# EAGLE board RAM Board trex (EAGLE 6.6.0)
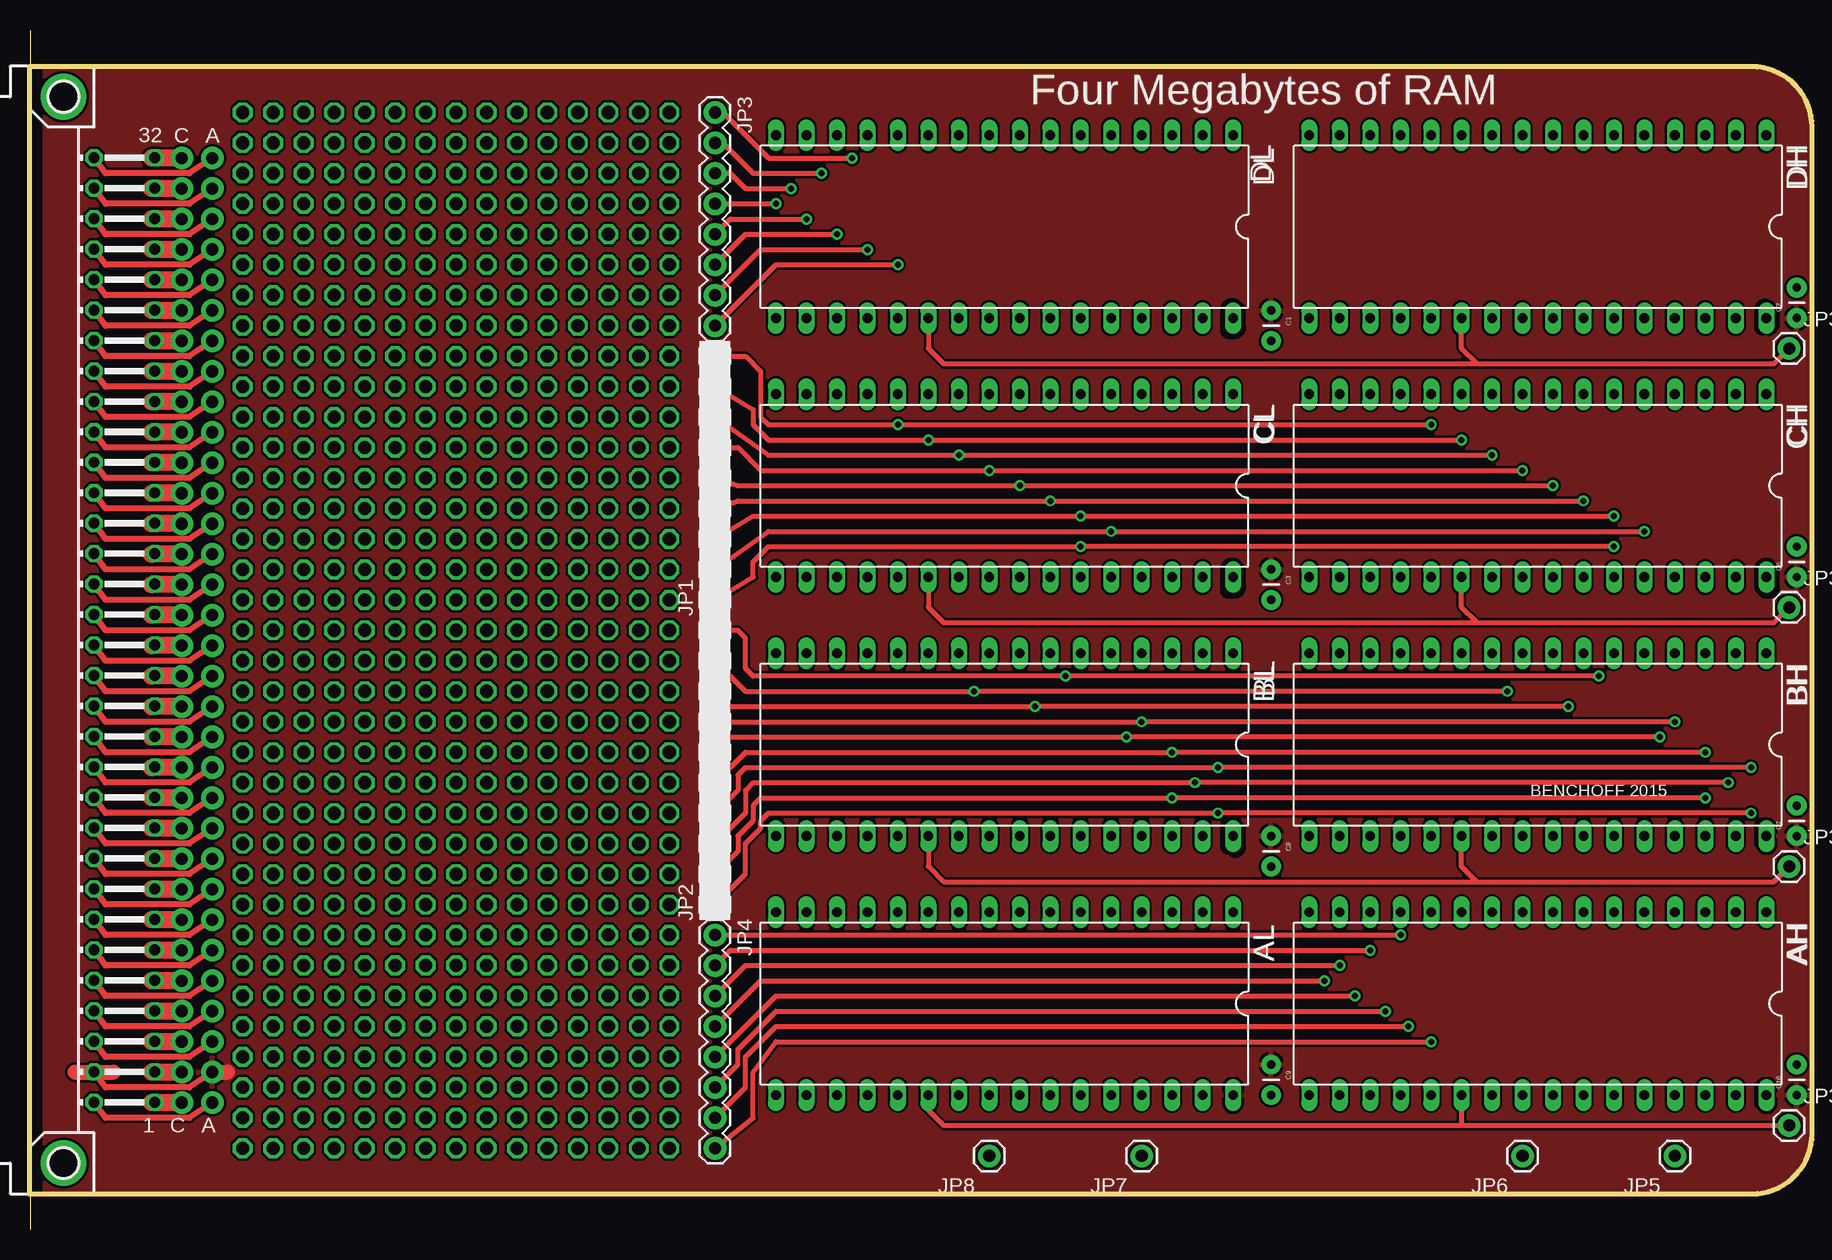
[diagram p1: board, top side]
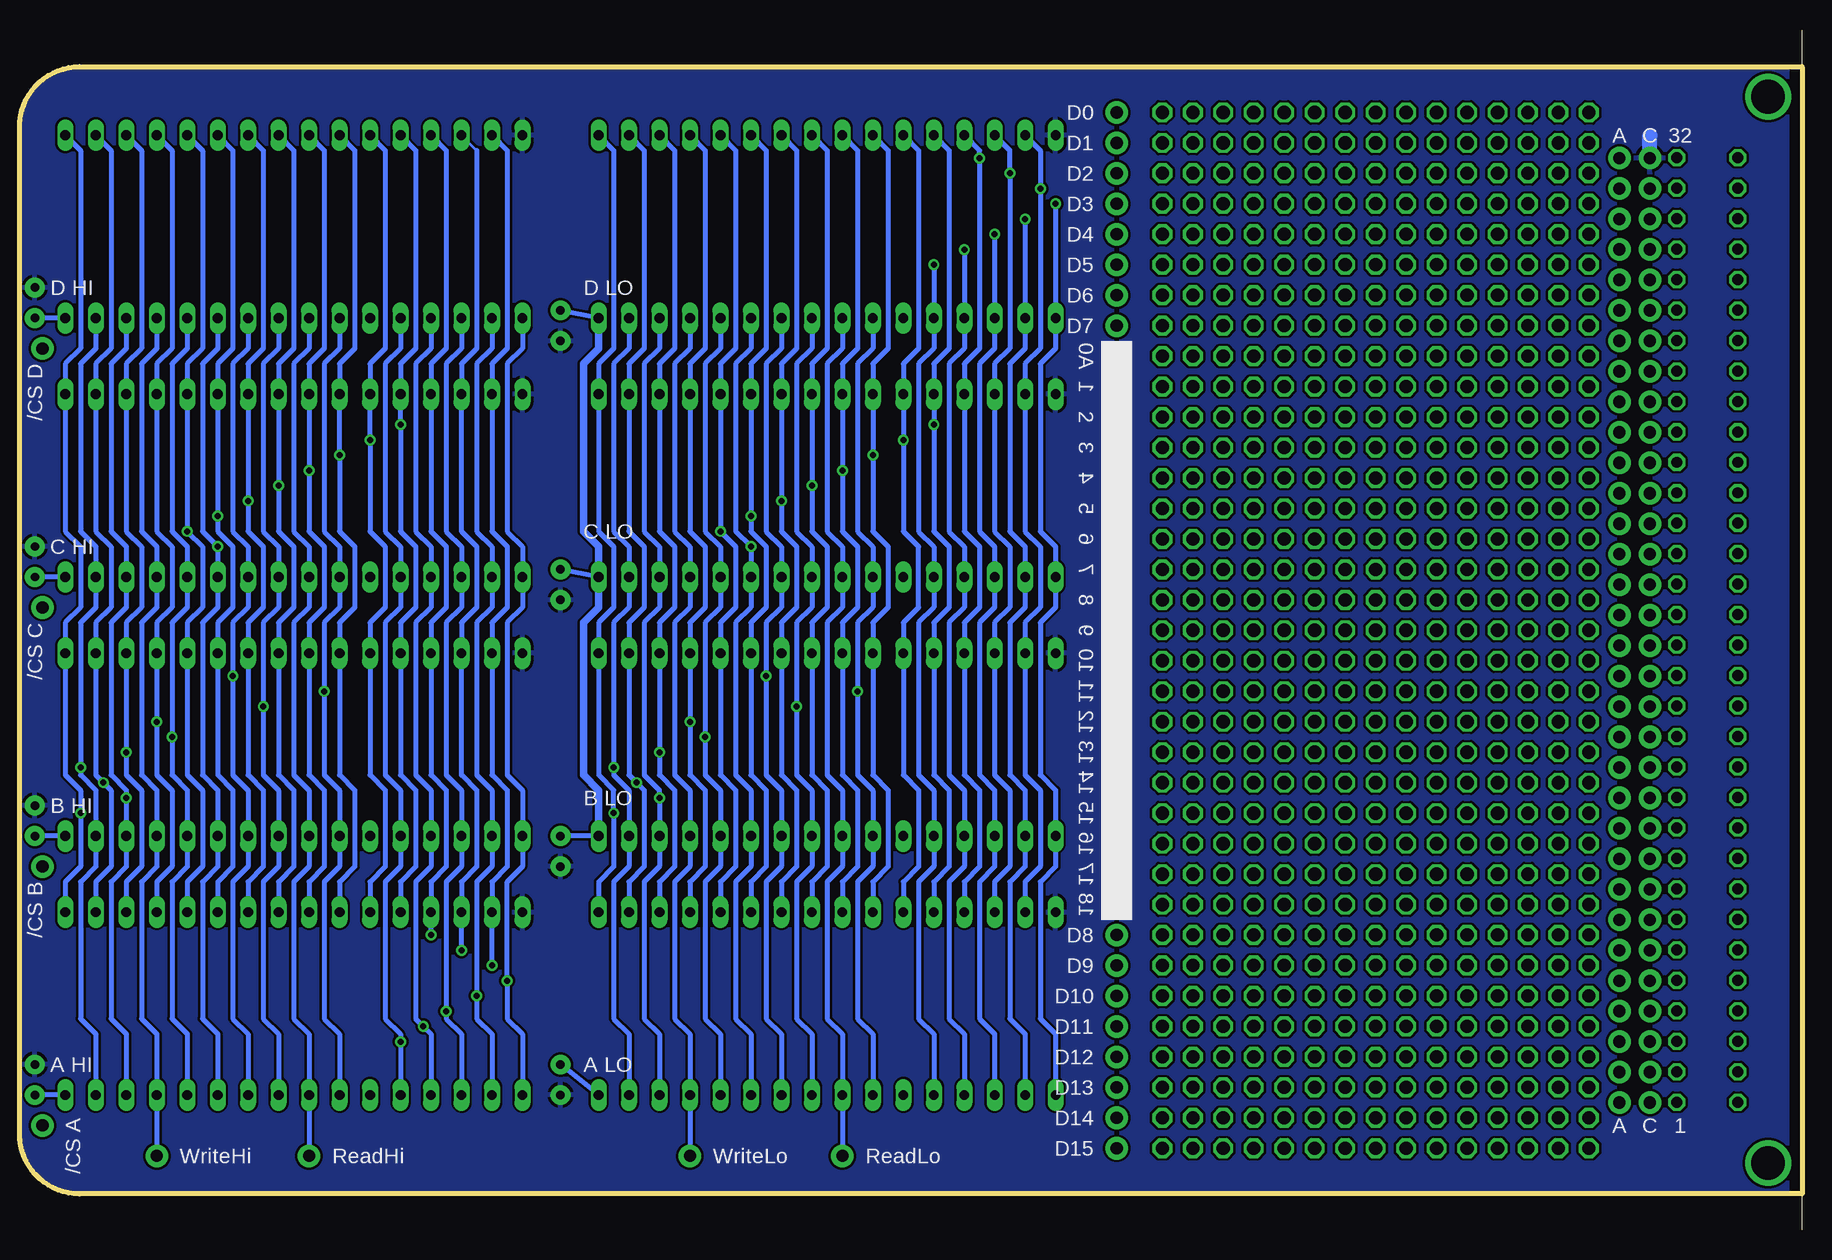
[diagram p2: board, bottom side, seen from below]

Size 0 x 100.03 mm. Coordinates in mm from the lower left corner, seen from the top.
Copper layers (1*16): Top 0.035mm / dielectric 1.5mm / Bottom 0.035mm
Design rules "default": minimum track width 10mil, minimum drill 24mil, track to track 8mil, track to pad 8mil, pad to pad 8mil, via to via 8mil, smd to smd 8mil, copper to edge 40mil, drill to drill 8mil, minimum pad ring 10mil, minimum via ring 8mil, stop-mask expansion 4mil, vias tented up to drill 0mil, thermal gap 10mil
tRestrict: area 99.6,31.6 to 100.9,34.1; area 99.6,31.6 to 100.9,34.1; area 99.8,31.6 to 100.7,33.7; area 99.8,53.3 to 100.7,55.4; area 99.8,74.9 to 100.7,77; area 144.3,75.2 to 145.2,77; area 144.3,53.3 to 145.2,55.4; area 144.3,31.9 to 144.9,33.7; area 144.6,10.3 to 144.9,12.1; area 144.3,10.6 to 144.9,12.1; area 100.1,10.3 to 100.4,12.1
Milling: 6 lines

## Footprints (pad centres in the part's own frame; a part is rotated, then mirrored left to right if it is on the bottom)
DIL32 = drill 0.813 long: 1 -17.78,-7.62; 2 -15.24,-7.62; 3 -12.7,-7.62; 4 -10.16,-7.62; 5 -7.62,-7.62; 6 -5.08,-7.62; 7 -2.54,-7.62; 8 0,-7.62; 9 2.54,-7.62; 10 5.08,-7.62; 11 7.62,-7.62; 12 10.16,-7.62; 13 12.7,-7.62; 14 15.24,-7.62; 15 17.78,-7.62; 16 20.32,-7.62; 17 20.32,7.62; 18 17.78,7.62; 19 15.24,7.62; 20 12.7,7.62; 21 10.16,7.62; 22 7.62,7.62; 23 5.08,7.62; 24 2.54,7.62; 25 0,7.62; 26 -2.54,7.62; 27 -5.08,7.62; 28 -7.62,7.62; 29 -10.16,7.62; 30 -12.7,7.62; 31 -15.24,7.62; 32 -17.78,7.62
CAP-PTH-SMALL = drill 0.7 pad 1.651: 1 0,0; 2 2.54,0
1X09 = drill 1.016 pad 1.88: 1 0,0; 2 2.54,0; 3 5.08,0; 4 7.62,0; 5 10.16,0; 6 12.7,0; 7 15.24,0; 8 17.78,0; 9 20.32,0
1X10 = drill 1.016 pad 1.88: 1 0,0; 2 2.54,0; 3 5.08,0; 4 7.62,0; 5 10.16,0; 6 12.7,0; 7 15.24,0; 8 17.78,0; 9 20.32,0; 10 22.86,0
1X08_ROUND = drill 1.016 pad 1.88: 1 0,0; 2 2.54,0; 3 5.08,0; 4 7.62,0; 5 10.16,0; 6 12.7,0; 7 15.24,0; 8 17.78,0
1X01 = drill 1.016 pad 1.88: 1 0,0
BLANKBOARD = drill 1.016 pad 1.88: 3V3 -13.97,37.465; 5V -16.51,34.925; 5VSB -13.97,34.925; 12V -16.51,37.465; 26 -13.97,6.985; 28 -13.97,4.445; 30 -13.97,1.905; 32 -13.97,-0.635; 34 -13.97,-3.175; 36 -13.97,-5.715; 40 -13.97,-10.795; -12V -16.51,-41.275; /AS -13.97,-20.955; /BOOT -16.51,12.065; /CLOCK -13.97,-26.035; /LDS -13.97,-18.415; /RESET -13.97,-8.255; /UDS -13.97,-15.875; /VMA -16.51,14.605; /VPA -16.51,9.525; A0 -13.97,-28.575; A1 -13.97,-31.115; A2 -13.97,-33.655; A3 -13.97,-36.195; A4 -13.97,-38.735; A5 -16.51,-38.735; A6 -16.51,-36.195; A7 -16.51,-33.655; A8 -16.51,-31.115; A9 -16.51,-28.575; A10 -16.51,-26.035; A11 -16.51,-23.495; A12 -16.51,-20.955; A13 -16.51,-18.415; A14 -16.51,-15.875; A15 -16.51,-13.335; A16 -16.51,-10.795; A17 -16.51,-8.255; A18 -16.51,-5.715; A19 -16.51,-3.175; A20 -16.51,-0.635; A21 -16.51,1.905; A22 -16.51,4.445; A23 -16.51,6.985; CLOCK -13.97,-23.495; D0 -16.51,19.685; D1 -16.51,22.225; D2 -16.51,24.765; D3 -16.51,27.305; D4 -16.51,29.845; D5 -16.51,32.385; D6 -13.97,32.385; D7 -13.97,29.845; D8 -13.97,27.305; D9 -13.97,24.765; D10 -13.97,22.225; D11 -13.97,19.685; D12 -13.97,17.145; D13 -13.97,14.605; D14 -13.97,12.065; D15 -13.97,9.525; E -16.51,17.145; GND -13.97,-41.275; R/W -13.97,-13.335 | drill 0.914 octagon: F1 -6.651,37.428; F2 -6.651,34.888; F3 -6.651,32.348; F4 -6.651,29.808; F5 -6.651,27.268; F6 -6.651,24.728; F7 -6.651,22.188; F8 -6.651,19.648; F9 -6.651,17.108; F10 -6.651,14.568; F11 -6.651,12.028; F12 -6.651,9.488; F13 -6.651,6.948; F14 -6.651,4.408; F15 -6.651,1.868; F16 -6.651,-0.672; F17 -6.651,-3.212; F18 -6.651,-5.752; F19 -6.651,-8.292; F20 -6.651,-10.832; F21 -6.651,-13.372; F22 -6.651,-15.912; F23 -6.651,-18.452; F24 -6.651,-20.992; F25 -6.651,-23.532; F26 -6.651,-26.072; F27 -6.651,-28.612; F28 -6.651,-31.152; F29 -6.651,-33.692; F30 -6.651,-36.232; F31 -6.651,-38.772; F32 -6.651,-41.312; R1 -11.731,-41.312; R2 -11.731,-38.772; R3 -11.731,-36.232; R4 -11.731,-33.692; R5 -11.731,-31.152; R6 -11.731,-28.612; R7 -11.731,-26.072; R8 -11.731,-23.532; R9 -11.731,-20.992; R10 -11.731,-18.452; R11 -11.731,-15.912; R12 -11.731,-13.372; R13 -11.731,-10.832; R14 -11.731,-8.292; R15 -11.731,-5.752; R16 -11.731,-3.212; R17 -11.731,-0.672; R18 -11.731,1.868; R19 -11.731,4.408; R21 -11.731,9.488; R22 -11.731,12.028; R23 -11.731,14.568; R24 -11.731,17.108; R25 -11.731,19.648; R26 -11.731,22.188; R27 -11.731,24.728; R28 -11.731,27.268; R29 -11.731,29.808; R30 -11.731,32.348; R31 -11.731,34.888; R32 -11.731,37.428; R200 -11.731,6.948 | drill 2.8: P$1 -4.111,42.508; P$2 -4.111,-46.392

## Placement (x,y rotation side)
AH  AS6C4008  [DIL32]  126.95,18.86 180 top  (outside the outline)
AL  AS6C4008  [DIL32]  82.5,18.86 180 top  (outside the outline)
BH  AS6C4008  [DIL32]  126.95,40.45 180 top  (outside the outline)
BL  AS6C4008  [DIL32]  82.5,40.45 180 top  (outside the outline)
C1  100nF  [CAP-PTH-SMALL]  103.46,76.65 270 top  (outside the outline)
C2  100nF  [CAP-PTH-SMALL]  147.27,76.01 90 top  (outside the outline)
C3  100nF  [CAP-PTH-SMALL]  103.46,55.06 270 top  (outside the outline)
C6  100nF  [CAP-PTH-SMALL]  147.27,54.42 90 top  (outside the outline)
C7  100nF  [CAP-PTH-SMALL]  147.27,32.83 90 top  (outside the outline)
C8  100nF  [CAP-PTH-SMALL]  103.46,32.83 270 top  (outside the outline)
C9  100nF  [CAP-PTH-SMALL]  103.46,13.78 270 top  (outside the outline)
C10  100nF  [CAP-PTH-SMALL]  147.27,11.24 90 top  (outside the outline)
CH  AS6C4008  [DIL32]  126.95,62.04 180 top  (outside the outline)
CL  AS6C4008  [DIL32]  82.5,62.04 180 top  (outside the outline)
DH  AS6C4008  [DIL32]  126.95,83.63 180 top  (outside the outline)
DL  AS6C4008  [DIL32]  82.5,83.63 180 top  (outside the outline)
JP1  M09  [1X09]  57.1,52.52 90 top  (outside the outline)
JP2  M10SILK_FEMALE_PTH  [1X10]  57.1,27.12 90 top  (outside the outline)
JP3  [1X08_ROUND]  57.1,93.16 270 top  (outside the outline)
JP4  [1X08_ROUND]  57.1,24.58 270 top  (outside the outline)
JP5  M01PTH  [1X01]  137.11,6.16 180 top  (outside the outline)
JP6  M01PTH  [1X01]  124.41,6.16 180 top  (outside the outline)
JP7  M01PTH  [1X01]  92.66,6.16 180 top  (outside the outline)
JP8  M01PTH  [1X01]  79.96,6.16 180 top  (outside the outline)
JP36  M01PTH  [1X01]  146.64,73.47 0 top  (outside the outline)
JP37  M01PTH  [1X01]  146.64,51.88 0 top  (outside the outline)
JP38  M01PTH  [1X01]  146.64,30.29 0 top  (outside the outline)
JP39  M01PTH  [1X01]  146.64,8.7 0 top  (outside the outline)
U$1  BACKPLANECONN  [BLANKBOARD]  -1.32,48.07 180 top

## Tracks (layer width: path | path; a pad name or v marks a point on that pad's centre or on a via)
ADDRESS0  (via drill 0.5 pad 0.25)
  Top 0.406: v116.79,67.12 v72.34,67.12 61.55,67.12 60.91,67.76 60.91,71.57 59.64,72.84 JP1.9
  Bottom 0.406: DH.12 115.52,89.98 115.52,73.47 116.79,72.2 CH.12 v116.79,67.12 116.79,58.23 115.52,56.96 115.52,51.88 116.79,50.61 BH.12 116.79,37.91 115.52,36.64 115.52,30.29 116.79,29.02 AH.12 | AL.12 72.34,29.02 71.07,30.29 71.07,36.64 72.34,37.91 BL.12 72.34,50.61 71.07,51.88 71.07,56.96 72.34,58.23 v72.34,67.12 CL.12 72.34,72.2 71.07,73.47 71.07,89.98 DL.12
ADDRESS1  (via drill 0.5 pad 0.25)
  Top 0.406: v119.33,65.85 v74.88,65.85 61.55,65.85 60.28,67.12 60.28,68.39 JP1.8
  Bottom 0.406: DH.11 118.06,89.98 118.06,73.47 119.33,72.2 CH.11 v119.33,65.85 119.33,58.23 118.06,56.96 118.06,51.88 119.33,50.61 BH.11 119.33,37.91 118.06,36.64 118.06,30.29 119.33,29.02 AH.11 | AL.11 74.88,29.02 73.61,30.29 73.61,36.64 74.88,37.91 BL.11 74.88,50.61 73.61,51.88 73.61,56.96 74.88,58.23 v74.88,65.85 CL.11 74.88,72.2 73.61,73.47 73.61,89.98 DL.11
ADDRESS2  (via drill 0.5 pad 0.25)
  Top 0.406: v121.87,64.58 v77.42,64.58 61.55,64.58 JP1.7
  Bottom 0.406: DH.10 120.6,89.98 120.6,73.47 121.87,72.2 CH.10 v121.87,64.58 121.87,58.23 120.6,56.96 120.6,51.88 121.87,50.61 BH.10 121.87,37.91 120.6,36.64 120.6,30.29 121.87,29.02 AH.10 | AL.10 77.42,29.02 76.15,30.29 76.15,36.64 77.42,37.91 BL.10 77.42,50.61 76.15,51.88 76.15,56.96 77.42,58.23 v77.42,64.58 CL.10 77.42,72.2 76.15,73.47 76.15,89.98 DL.10
ADDRESS3  (via drill 0.5 pad 0.25)
  Top 0.406: v124.41,63.31 v79.96,63.31 60.91,63.31 59.01,65.22 JP1.6
  Bottom 0.406: DH.9 123.14,89.98 123.14,73.47 124.41,72.2 CH.9 v124.41,63.31 124.41,58.23 123.14,56.96 123.14,51.88 124.41,50.61 BH.9 124.41,37.91 123.14,36.64 123.14,30.29 124.41,29.02 AH.9 | AL.9 79.96,29.02 78.69,30.29 78.69,36.64 79.96,37.91 BL.9 79.96,50.61 78.69,51.88 78.69,56.96 79.96,58.23 v79.96,63.31 CL.9 79.96,72.2 78.69,73.47 78.69,89.98 DL.9
ADDRESS4  (via drill 0.5 pad 0.25)
  Top 0.406: v126.95,62.04 v82.5,62.04 59.01,62.04 JP1.5
  Bottom 0.406: DH.8 125.68,89.98 125.68,73.47 126.95,72.2 CH.8 v126.95,62.04 126.95,58.23 125.68,56.96 125.68,51.88 126.95,50.61 BH.8 126.95,37.91 125.68,36.64 125.68,30.29 126.95,29.02 AH.8 | AL.8 82.5,29.02 81.23,30.29 81.23,36.64 82.5,37.91 BL.8 82.5,50.61 81.23,51.88 81.23,56.96 82.5,58.23 v82.5,62.04 CL.8 82.5,72.2 81.23,73.47 81.23,89.98 DL.8
ADDRESS5  (via drill 0.5 pad 0.25)
  Top 0.406: v129.49,60.77 v85.04,60.77 59.01,60.77 JP1.4
  Bottom 0.406: DH.7 128.22,89.98 128.22,73.47 129.49,72.2 CH.7 v129.49,60.77 129.49,58.23 128.22,56.96 128.22,51.88 129.49,50.61 BH.7 129.49,37.91 128.22,36.64 128.22,30.29 129.49,29.02 AH.7 | AL.7 85.04,29.02 83.77,30.29 83.77,36.64 85.04,37.91 BL.7 85.04,50.61 83.77,51.88 83.77,56.96 85.04,58.23 v85.04,60.77 CL.7 85.04,72.2 83.77,73.47 83.77,89.98 DL.7
ADDRESS6  (via drill 0.5 pad 0.25)
  Top 0.406: v132.03,59.5 v87.58,59.5 60.28,59.5 JP1.3
  Bottom 0.406: DH.6 130.76,89.98 130.76,73.47 132.03,72.2 CH.6 v132.03,59.5 132.03,58.23 130.76,56.96 130.76,51.88 132.03,50.61 BH.6 132.03,37.91 130.76,36.64 130.76,30.29 132.03,29.02 AH.6 | AL.6 87.58,29.02 86.31,30.29 86.31,36.64 87.58,37.91 BL.6 87.58,50.61 86.31,51.88 86.31,56.96 87.58,58.23 v87.58,59.5 CL.6 87.58,72.2 86.31,73.47 86.31,89.98 DL.6
ADDRESS7  (via drill 0.5 pad 0.25)
  Top 0.406: v134.57,58.23 v90.12,58.23 61.55,58.23 JP1.2
  Bottom 0.406: DH.5 133.3,89.98 133.3,73.47 134.57,72.2 CH.5 v134.57,58.23 133.3,56.96 133.3,51.88 134.57,50.61 BH.5 134.57,37.91 133.3,36.64 133.3,30.29 134.57,29.02 AH.5 | AL.5 90.12,29.02 88.85,30.29 88.85,36.64 90.12,37.91 BL.5 90.12,50.61 88.85,51.88 88.85,56.96 v90.12,58.23 CL.5 90.12,72.2 88.85,73.47 88.85,89.98 DL.5
ADDRESS8  (via drill 0.5 pad 0.25)
  Top 0.406: v132.03,56.96 v87.58,56.96 61.55,56.96 60.28,55.69 60.28,54.42 JP1.1
  Bottom 0.406: DL.27 87.58,73.47 88.85,72.2 88.85,58.23 v87.58,56.96 CL.27 87.58,51.88 88.85,50.61 88.85,37.91 87.58,36.64 BL.27 87.58,30.29 88.85,29.02 88.85,17.59 87.58,16.32 AL.27 | DH.27 132.03,73.47 133.3,72.2 133.3,58.23 v132.03,56.96 CH.27 132.03,51.88 133.3,50.61 133.3,37.91 132.03,36.64 BH.27 132.03,30.29 133.3,29.02 133.3,17.59 132.03,16.32 AH.27
ADDRESS9  (via drill 0.5 pad 0.25)
  Top 0.406: v130.76,46.17 v86.31,46.17 60.28,46.17 59.64,46.8 59.64,49.34 59.01,49.98 JP2.10
  Bottom 0.406: DL.26 85.04,73.47 86.31,72.2 86.31,58.23 85.04,56.96 CL.26 85.04,51.88 86.31,50.61 v86.31,46.17 86.31,37.91 85.04,36.64 BL.26 85.04,30.29 86.31,29.02 86.31,17.59 85.04,16.32 AL.26 | DH.26 129.49,73.47 130.76,72.2 130.76,58.23 129.49,56.96 CH.26 129.49,51.88 130.76,50.61 v130.76,46.17 130.76,37.91 129.49,36.64 BH.26 129.49,30.29 130.76,29.02 130.76,17.59 129.49,16.32 AH.26
ADDRESS10  (via drill 0.5 pad 0.25)
  Top 0.406: v123.14,44.9 v78.69,44.9 59.64,44.9 JP2.9
  Bottom 0.406: DL.23 77.42,73.47 78.69,72.2 78.69,58.23 77.42,56.96 CL.23 77.42,51.88 78.69,50.61 v78.69,44.9 78.69,37.91 77.42,36.64 BL.23 77.42,30.29 78.69,29.02 78.69,17.59 77.42,16.32 AL.23 | DH.23 121.87,73.47 123.14,72.2 123.14,58.23 121.87,56.96 CH.23 121.87,51.88 123.14,50.61 v123.14,44.9 123.14,37.91 121.87,36.64 BH.23 121.87,30.29 123.14,29.02 123.14,17.59 121.87,16.32 AH.23
ADDRESS11  (via drill 0.5 pad 0.25)
  Top 0.406: v128.22,43.63 v83.77,43.63 58.37,43.63 JP2.8
  Bottom 0.406: DL.25 82.5,73.47 83.77,72.2 83.77,58.23 82.5,56.96 CL.25 82.5,51.88 83.77,50.61 v83.77,43.63 83.77,37.91 82.5,36.64 BL.25 82.5,30.29 83.77,29.02 83.77,17.59 82.5,16.32 AL.25 | DH.25 126.95,73.47 128.22,72.2 128.22,58.23 126.95,56.96 CH.25 126.95,51.88 128.22,50.61 v128.22,43.63 128.22,37.91 126.95,36.64 BH.25 126.95,30.29 128.22,29.02 128.22,17.59 126.95,16.32 AH.25
ADDRESS12  (via drill 0.5 pad 0.25)
  Top 0.406: v137.11,42.36 v92.66,42.36 JP2.7
  Bottom 0.406: DH.4 135.84,89.98 135.84,73.47 137.11,72.2 CH.4 137.11,58.23 135.84,56.96 135.84,51.88 137.11,50.61 BH.4 v137.11,42.36 137.11,37.91 135.84,36.64 135.84,30.29 137.11,29.02 AH.4 | AL.4 92.66,29.02 91.39,30.29 91.39,36.64 92.66,37.91 v92.66,42.36 BL.4 92.66,50.61 91.39,51.88 91.39,56.96 92.66,58.23 CL.4 92.66,72.2 91.39,73.47 91.39,89.98 DL.4
ADDRESS13  (via drill 0.5 pad 0.25)
  Top 0.406: v135.84,41.09 v91.39,41.09 58.37,41.09 JP2.6
  Bottom 0.406: DL.28 90.12,73.47 91.39,72.2 91.39,58.23 90.12,56.96 CL.28 90.12,51.88 91.39,50.61 v91.39,41.09 91.39,37.91 90.12,36.64 BL.28 90.12,30.29 91.39,29.02 91.39,17.59 90.12,16.32 AL.28 | DH.28 134.57,73.47 135.84,72.2 135.84,58.23 134.57,56.96 CH.28 134.57,51.88 135.84,50.61 v135.84,41.09 135.84,37.91 134.57,36.64 BH.28 134.57,30.29 135.84,29.02 135.84,17.59 134.57,16.32 AH.28
ADDRESS14  (via drill 0.5 pad 0.25)
  Top 0.406: v139.65,39.82 v95.2,39.82 59.64,39.82 JP2.5
  Bottom 0.406: DH.3 138.38,89.98 138.38,73.47 139.65,72.2 CH.3 139.65,58.23 138.38,56.96 138.38,51.88 139.65,50.61 BH.3 v139.65,39.82 139.65,37.91 138.38,36.64 138.38,30.29 139.65,29.02 AH.3 | AL.3 95.2,29.02 93.93,30.29 93.93,36.64 95.2,37.91 v95.2,39.82 BL.3 95.2,50.61 93.93,51.88 93.93,56.96 95.2,58.23 CL.3 95.2,72.2 93.93,73.47 93.93,89.98 DL.3
ADDRESS15  (via drill 0.5 pad 0.25)
  Top 0.406: v143.46,38.55 v99.01,38.55 59.64,38.55 59.01,37.91 59.01,36.64 JP2.4
  Bottom 0.406: DL.31 97.74,73.47 99.01,72.2 99.01,58.23 97.74,56.96 CL.31 97.74,51.88 99.01,50.61 v99.01,38.55 99.01,37.91 97.74,36.64 BL.31 97.74,30.29 99.01,29.02 99.01,17.59 97.74,16.32 AL.31 | DH.31 142.19,73.47 143.46,72.2 143.46,58.23 142.19,56.96 CH.31 142.19,51.88 143.46,50.61 v143.46,38.55 143.46,37.91 142.19,36.64 BH.31 142.19,30.29 143.46,29.02 143.46,17.59 142.19,16.32 AH.31
ADDRESS16  (via drill 0.5 pad 0.25)
  Top 0.406: v141.56,37.28 v97.11,37.28 60.28,37.28 59.64,36.64 59.64,34.74 JP2.3 57.74,32.2
  Bottom 0.406: DH.2 140.92,89.98 140.92,73.47 142.19,72.2 CH.2 142.19,58.23 140.92,56.96 140.92,51.88 142.19,50.61 BH.2 142.19,37.91 v141.56,37.28 140.92,36.64 140.92,30.29 142.19,29.02 AH.2 | AL.2 97.74,29.02 96.47,30.29 96.47,36.64 v97.11,37.28 97.74,37.91 BL.2 97.74,50.61 96.47,51.88 96.47,56.96 97.74,58.23 CL.2 97.74,72.2 96.47,73.47 96.47,89.98 DL.2
ADDRESS17  (via drill 0.5 pad 0.25)
  Top 0.406: v139.65,36.01 v95.2,36.01 60.91,36.01 60.28,35.37 60.28,34.1 59.01,32.83 59.01,31.56 JP2.2
  Bottom 0.406: DL.30 95.2,73.47 96.47,72.2 96.47,58.23 95.2,56.96 CL.30 95.2,51.88 96.47,50.61 96.47,37.91 95.2,36.64 v95.2,36.01 BL.30 95.2,30.29 96.47,29.02 96.47,17.59 95.2,16.32 AL.30 | DH.30 139.65,73.47 140.92,72.2 140.92,58.23 139.65,56.96 CH.30 139.65,51.88 140.92,50.61 140.92,37.91 139.65,36.64 v139.65,36.01 BH.30 139.65,30.29 140.92,29.02 140.92,17.59 139.65,16.32 AH.30
ADDRESS18  (via drill 0.5 pad 0.25)
  Top 0.406: v143.46,34.74 v99.01,34.74 61.55,34.74 60.91,34.1 60.91,33.47 59.64,32.2 59.64,29.66 JP2.1
  Bottom 0.406: DH.1 143.46,89.98 143.46,73.47 144.73,72.2 CH.1 144.73,58.23 143.46,56.96 143.46,51.88 144.73,50.61 BH.1 144.73,37.91 143.46,36.64 v143.46,34.74 143.46,30.29 144.73,29.02 AH.1 | AL.1 100.28,29.02 99.01,30.29 v99.01,34.74 99.01,36.64 100.28,37.91 BL.1 100.28,50.61 99.01,51.88 99.01,56.96 100.28,58.23 CL.1 100.28,72.2 99.01,73.47 99.01,89.98 DL.1
BANKACS
  Top 0.406: AL.22 74.88,9.97 76.15,8.7 119.33,8.7 | 119.33,8.7 JP39.1 | AH.22 119.33,8.7
BANKBCS
  Top 0.406: BL.22 74.88,30.29 76.15,29.02 120.6,29.02 | 120.6,29.02 119.33,30.29 BH.22 | 120.6,29.02 145.37,29.02 JP38.1
BANKCCS
  Top 0.406: CL.22 74.88,51.88 76.15,50.61 120.6,50.61 | 120.6,50.61 119.33,51.88 CH.22 | 120.6,50.61 145.37,50.61 JP37.1
BANKDCS
  Top 0.406: DL.22 74.88,73.47 76.15,72.2 120.6,72.2 | 120.6,72.2 119.33,73.47 DH.22 | 120.6,72.2 145.37,72.2 JP36.1
DATA0  (via drill 0.5 pad 0.25)
  Top 0.406: v68.53,89.35 61.55,89.35 57.74,93.16 JP3.1
  Bottom 0.406: DL.13 68.53,89.98 v68.53,89.35 68.53,73.47 69.8,72.2 CL.13 69.8,58.23 68.53,56.96 68.53,51.88 69.8,50.61 BL.13 69.8,37.91 68.53,36.64 68.53,30.29 69.8,29.02 AL.13
DATA1  (via drill 0.5 pad 0.25)
  Top 0.406: v65.99,88.08 60.28,88.08 57.74,90.62 JP3.2
  Bottom 0.406: DL.14 65.99,89.98 v65.99,88.08 65.99,73.47 67.26,72.2 CL.14 67.26,58.23 65.99,56.96 65.99,51.88 67.26,50.61 BL.14 67.26,37.91 65.99,36.64 65.99,30.29 67.26,29.02 AL.14
DATA2  (via drill 0.5 pad 0.25)
  Top 0.406: JP3.3 58.37,88.08 59.64,86.81 v63.45,86.81
  Bottom 0.406: DL.15 63.45,89.98 v63.45,86.81 63.45,73.47 64.72,72.2 CL.15 64.72,58.23 63.45,56.96 63.45,51.88 64.72,50.61 BL.15 64.72,37.91 63.45,36.64 63.45,30.29 64.72,29.02 AL.15
DATA3  (via drill 0.5 pad 0.25)
  Top 0.406: JP3.4 v62.18,85.54
  Bottom 0.406: AL.17 62.18,16.32 63.45,17.59 63.45,29.02 62.18,30.29 BL.17 62.18,36.64 63.45,37.91 63.45,50.61 62.18,51.88 CL.17 62.18,56.96 63.45,58.23 63.45,72.2 62.18,73.47 DL.17 v62.18,85.54
DATA4  (via drill 0.5 pad 0.25)
  Top 0.406: JP3.5 58.37,84.27 v64.72,84.27
  Bottom 0.406: AL.18 64.72,16.32 65.99,17.59 65.99,29.02 64.72,30.29 BL.18 64.72,36.64 65.99,37.91 65.99,50.61 64.72,51.88 CL.18 64.72,56.96 65.99,58.23 65.99,72.2 64.72,73.47 DL.18 v64.72,84.27
DATA5  (via drill 0.5 pad 0.25)
  Top 0.406: JP3.6 59.64,83 v67.26,83
  Bottom 0.406: AL.19 67.26,16.32 68.53,17.59 68.53,29.02 67.26,30.29 BL.19 67.26,36.64 68.53,37.91 68.53,50.61 67.26,51.88 CL.19 67.26,56.96 68.53,58.23 68.53,72.2 67.26,73.47 DL.19 v67.26,83
DATA6  (via drill 0.5 pad 0.25)
  Top 0.406: JP3.7 60.91,81.73 v69.8,81.73
  Bottom 0.406: AL.20 69.8,16.32 71.07,17.59 71.07,29.02 69.8,30.29 BL.20 69.8,36.64 71.07,37.91 71.07,50.61 69.8,51.88 CL.20 69.8,56.96 71.07,58.23 71.07,72.2 69.8,73.47 DL.20 v69.8,81.73
DATA7  (via drill 0.5 pad 0.25)
  Top 0.406: JP3.8 62.18,80.46 v72.34,80.46
  Bottom 0.406: AL.21 72.34,16.32 73.61,17.59 73.61,29.02 72.34,30.29 BL.21 72.34,36.64 73.61,37.91 73.61,50.61 72.34,51.88 CL.21 72.34,56.96 73.61,58.23 73.61,72.2 72.34,73.47 DL.21 v72.34,80.46
DATA8  (via drill 0.5 pad 0.25)
  Top 0.406: JP4.1 v114.25,24.58
  Bottom 0.406: DH.13 112.98,89.98 112.98,73.47 114.25,72.2 CH.13 114.25,58.23 112.98,56.96 112.98,51.88 114.25,50.61 BH.13 114.25,37.91 112.98,36.64 112.98,30.29 114.25,29.02 AH.13 v114.25,24.58
DATA9  (via drill 0.5 pad 0.25)
  Top 0.406: JP4.2 58.37,23.31 v111.71,23.31
  Bottom 0.254: 110.44,89.98 DH.14
  Bottom 0.406: 110.44,89.98 110.44,73.47 111.71,72.2 CH.14 111.71,58.23 110.44,56.96 110.44,51.88 111.71,50.61 BH.14 111.71,37.91 110.44,36.64 110.44,30.29 111.71,29.02 AH.14 v111.71,23.31
DATA10  (via drill 0.5 pad 0.25)
  Top 0.406: JP4.3 59.64,22.04 v109.17,22.04
  Bottom 0.406: DH.15 107.9,89.98 107.9,73.47 109.17,72.2 CH.15 109.17,58.23 107.9,56.96 107.9,51.88 109.17,50.61 BH.15 109.17,37.91 107.9,36.64 107.9,30.29 109.17,29.02 AH.15 v109.17,22.04
DATA11  (via drill 0.5 pad 0.25)
  Top 0.406: JP4.4 60.91,20.77 v107.9,20.77
  Bottom 0.406: DH.17 106.63,73.47 107.9,72.2 107.9,58.23 106.63,56.96 CH.17 106.63,51.88 107.9,50.61 107.9,37.91 106.63,36.64 BH.17 106.63,30.29 107.9,29.02 v107.9,20.77 107.9,17.59 106.63,16.32 AH.17
DATA12  (via drill 0.5 pad 0.25)
  Top 0.406: JP4.5 62.18,19.5 v110.44,19.5
  Bottom 0.406: DH.18 109.17,73.47 110.44,72.2 110.44,58.23 109.17,56.96 CH.18 109.17,51.88 110.44,50.61 110.44,37.91 109.17,36.64 BH.18 109.17,30.29 110.44,29.02 v110.44,19.5 110.44,17.59 109.17,16.32 AH.18
DATA13  (via drill 0.5 pad 0.25)
  Top 0.406: JP4.6 59.01,13.78 59.01,15.05 62.18,18.23 v112.98,18.23
  Bottom 0.406: DH.19 111.71,73.47 112.98,72.2 112.98,58.23 111.71,56.96 CH.19 111.71,51.88 112.98,50.61 112.98,37.91 111.71,36.64 BH.19 111.71,30.29 112.98,29.02 v112.98,18.23 112.98,17.59 111.71,16.32 AH.19
DATA14  (via drill 0.5 pad 0.25)
  Top 0.406: JP4.7 59.64,11.88 59.64,14.42 62.18,16.96 v114.89,16.96
  Bottom 0.406: DH.20 114.25,73.47 115.52,72.2 115.52,58.23 114.25,56.96 CH.20 114.25,51.88 115.52,50.61 115.52,37.91 114.25,36.64 BH.20 114.25,30.29 115.52,29.02 115.52,17.59 v114.89,16.96 114.25,16.32 AH.20
DATA15  (via drill 0.5 pad 0.25)
  Top 0.406: JP4.8 60.28,9.34 60.28,13.15 62.18,15.69 v116.79,15.69
  Bottom 0.406: DH.21 116.79,73.47 118.06,72.2 118.06,58.23 116.79,56.96 CH.21 116.79,51.88 118.06,50.61 118.06,37.91 116.79,36.64 BH.21 116.79,30.29 118.06,29.02 118.06,17.59 116.79,16.32 v116.79,15.69 AH.21
GND
  Bottom 1.27: U$1.GND 12.65,91.25
  pour Bottom: 148.54,8.07 148.54,91.89 arc90 143.46,96.97 0.59,96.97 0.59,2.99 143.46,2.99 arc90
N$1  (via drill 1.1)
  other vias: 53.29,93.16
N$2  (via drill 1.1)
  other vias: 50.75,93.16
N$3  (via drill 1.1)
  other vias: 48.21,93.16
N$4  (via drill 1.1)
  other vias: 45.67,93.16
N$5  (via drill 1.1)
  other vias: 43.13,93.16
N$6  (via drill 1.1)
  other vias: 40.59,93.16
N$7  (via drill 1.1)
  other vias: 38.05,93.16
N$8  (via drill 1.1)
  other vias: 35.51,93.16
N$9  (via drill 1.1)
  other vias: 32.97,93.16
N$10  (via drill 1.1)
  other vias: 30.43,93.16
N$11  (via drill 1.1)
  other vias: 27.89,93.16
N$12  (via drill 1.1)
  other vias: 25.35,93.16
N$13  (via drill 1.1)
  other vias: 22.81,93.16
N$14  (via drill 1.1)
  other vias: 20.27,93.16
N$15  (via drill 1.1)
  other vias: 17.73,93.16
N$16
  Top 1.27: 3.76,13.15 6.94,13.15
N$17  (via drill 1.1)
  other vias: 53.29,90.62
N$18  (via drill 1.1)
  other vias: 53.29,88.08
N$19  (via drill 1.1)
  other vias: 53.29,85.54
N$20  (via drill 1.1)
  other vias: 53.29,83
N$21  (via drill 1.1)
  other vias: 53.29,80.46
N$22  (via drill 1.1)
  other vias: 53.29,77.92
N$23  (via drill 1.1)
  other vias: 53.29,75.38
N$24  (via drill 1.1)
  other vias: 53.29,72.84
N$25  (via drill 1.1)
  other vias: 53.29,70.3
N$26  (via drill 1.1)
  other vias: 53.29,67.76
N$27  (via drill 1.1)
  other vias: 53.29,65.22
N$28  (via drill 1.1)
  other vias: 53.29,62.68
N$29  (via drill 1.1)
  other vias: 53.29,60.14
N$30  (via drill 1.1)
  other vias: 53.29,57.6
N$31  (via drill 1.1)
  other vias: 53.29,55.06
N$32  (via drill 1.1)
  other vias: 53.29,52.52
N$33  (via drill 1.1)
  other vias: 53.29,49.98
N$34  (via drill 1.1)
  other vias: 53.29,47.44
N$35  (via drill 1.1)
  other vias: 53.29,44.9
N$36  (via drill 1.1)
  other vias: 53.29,42.36
N$37  (via drill 1.1)
  other vias: 53.29,39.82
N$38  (via drill 1.1)
  other vias: 53.29,37.28
N$39  (via drill 1.1)
  other vias: 53.29,34.74
N$40  (via drill 1.1)
  other vias: 53.29,32.2
N$41  (via drill 1.1)
  other vias: 53.29,29.66
N$42  (via drill 1.1)
  other vias: 53.29,27.12
N$43  (via drill 1.1)
  other vias: 53.29,24.58
N$44  (via drill 1.1)
  other vias: 53.29,22.04
N$45  (via drill 1.1)
  other vias: 53.29,19.5
N$46  (via drill 1.1)
  other vias: 53.29,16.96
N$47  (via drill 1.1)
  other vias: 53.29,14.42
N$48  (via drill 1.1)
  other vias: 53.29,11.88
N$49  (via drill 1.1)
  other vias: 53.29,9.34
N$50  (via drill 1.1)
  other vias: 53.29,6.8
N$51  (via drill 1.1)
  other vias: 50.75,90.62
N$52  (via drill 1.1)
  other vias: 48.21,90.62
N$53  (via drill 1.1)
  other vias: 45.67,90.62
N$54  (via drill 1.1)
  other vias: 43.13,90.62
N$55  (via drill 1.1)
  other vias: 40.59,90.62
N$56  (via drill 1.1)
  other vias: 38.05,90.62
N$57  (via drill 1.1)
  other vias: 35.51,90.62
N$58  (via drill 1.1)
  other vias: 32.97,90.62
N$59  (via drill 1.1)
  other vias: 30.43,90.62
N$60  (via drill 1.1)
  other vias: 27.89,90.62
N$61  (via drill 1.1)
  other vias: 25.35,90.62
N$62  (via drill 1.1)
  other vias: 22.81,90.62
N$63  (via drill 1.1)
  other vias: 20.27,90.62
N$64  (via drill 1.1)
  other vias: 17.73,90.62
N$66  (via drill 1.1)
  other vias: 50.75,88.08
N$67  (via drill 1.1)
  other vias: 48.21,88.08
N$68  (via drill 1.1)
  other vias: 45.67,88.08
N$69  (via drill 1.1)
  other vias: 43.13,88.08
N$70  (via drill 1.1)
  other vias: 40.59,88.08
N$71  (via drill 1.1)
  other vias: 38.05,88.08
N$72  (via drill 1.1)
  other vias: 35.51,88.08
N$73  (via drill 1.1)
  other vias: 32.97,88.08
N$74  (via drill 1.1)
  other vias: 30.43,88.08
N$75  (via drill 1.1)
  other vias: 27.89,88.08
N$76  (via drill 1.1)
  other vias: 25.35,88.08
N$77  (via drill 1.1)
  other vias: 22.81,88.08
N$78  (via drill 1.1)
  other vias: 20.27,88.08
N$79  (via drill 1.1)
  other vias: 17.73,88.08
N$81  (via drill 1.1)
  other vias: 50.75,85.54
N$82  (via drill 1.1)
  other vias: 48.21,85.54
N$83  (via drill 1.1)
  other vias: 45.67,85.54
N$84  (via drill 1.1)
  other vias: 43.13,85.54
N$85  (via drill 1.1)
  other vias: 40.59,85.54
N$86  (via drill 1.1)
  other vias: 38.05,85.54
N$87  (via drill 1.1)
  other vias: 35.51,85.54
N$88  (via drill 1.1)
  other vias: 32.97,85.54
N$89  (via drill 1.1)
  other vias: 30.43,85.54
N$90  (via drill 1.1)
  other vias: 27.89,85.54
N$91  (via drill 1.1)
  other vias: 25.35,85.54
N$92  (via drill 1.1)
  other vias: 22.81,85.54
N$93  (via drill 1.1)
  other vias: 20.27,85.54
N$94  (via drill 1.1)
  other vias: 17.73,85.54
N$96  (via drill 1.1)
  other vias: 50.75,83
N$97  (via drill 1.1)
  other vias: 48.21,83
N$98  (via drill 1.1)
  other vias: 45.67,83
N$99  (via drill 1.1)
  other vias: 43.13,83
N$100  (via drill 1.1)
  other vias: 40.59,83
N$101  (via drill 1.1)
  other vias: 38.05,83
N$102  (via drill 1.1)
  other vias: 35.51,83
N$103  (via drill 1.1)
  other vias: 32.97,83
N$104  (via drill 1.1)
  other vias: 30.43,83
N$105  (via drill 1.1)
  other vias: 27.89,83
N$106  (via drill 1.1)
  other vias: 25.35,83
N$107  (via drill 1.1)
  other vias: 22.81,83
N$108  (via drill 1.1)
  other vias: 20.27,83
N$109  (via drill 1.1)
  other vias: 17.73,83
N$111  (via drill 1.1)
  other vias: 50.75,80.46
N$112  (via drill 1.1)
  other vias: 48.21,80.46
N$113  (via drill 1.1)
  other vias: 45.67,80.46
N$114  (via drill 1.1)
  other vias: 43.13,80.46
N$115  (via drill 1.1)
  other vias: 40.59,80.46
N$116  (via drill 1.1)
  other vias: 38.05,80.46
N$117  (via drill 1.1)
  other vias: 35.51,80.46
N$118  (via drill 1.1)
  other vias: 32.97,80.46
N$119  (via drill 1.1)
  other vias: 30.43,80.46
N$120  (via drill 1.1)
  other vias: 27.89,80.46
N$121  (via drill 1.1)
  other vias: 25.35,80.46
N$122  (via drill 1.1)
  other vias: 22.81,80.46
N$123  (via drill 1.1)
  other vias: 20.27,80.46
N$124  (via drill 1.1)
  other vias: 17.73,80.46
N$126  (via drill 1.1)
  other vias: 50.75,77.92
N$127  (via drill 1.1)
  other vias: 48.21,77.92
N$128  (via drill 1.1)
  other vias: 45.67,77.92
N$129  (via drill 1.1)
  other vias: 43.13,77.92
N$130  (via drill 1.1)
  other vias: 40.59,77.92
N$131  (via drill 1.1)
  other vias: 38.05,77.92
N$132  (via drill 1.1)
  other vias: 35.51,77.92
N$133  (via drill 1.1)
  other vias: 32.97,77.92
N$134  (via drill 1.1)
  other vias: 30.43,77.92
N$135  (via drill 1.1)
  other vias: 27.89,77.92
N$136  (via drill 1.1)
  other vias: 25.35,77.92
N$137  (via drill 1.1)
  other vias: 22.81,77.92
N$138  (via drill 1.1)
  other vias: 20.27,77.92
N$139  (via drill 1.1)
  other vias: 17.73,77.92
N$141  (via drill 1.1)
  other vias: 50.75,75.38
N$142  (via drill 1.1)
  other vias: 48.21,75.38
N$143  (via drill 1.1)
  other vias: 45.67,75.38
N$144  (via drill 1.1)
  other vias: 43.13,75.38
N$145  (via drill 1.1)
  other vias: 40.59,75.38
N$146  (via drill 1.1)
  other vias: 38.05,75.38
N$147  (via drill 1.1)
  other vias: 35.51,75.38
N$148  (via drill 1.1)
  other vias: 32.97,75.38
N$149  (via drill 1.1)
  other vias: 30.43,75.38
N$150  (via drill 1.1)
  other vias: 27.89,75.38
N$151  (via drill 1.1)
  other vias: 25.35,75.38
N$152  (via drill 1.1)
  other vias: 22.81,75.38
N$153  (via drill 1.1)
  other vias: 20.27,75.38
N$154  (via drill 1.1)
  other vias: 17.73,75.38
N$156  (via drill 1.1)
  other vias: 50.75,72.84
N$157  (via drill 1.1)
  other vias: 48.21,72.84
N$158  (via drill 1.1)
  other vias: 45.67,72.84
N$159  (via drill 1.1)
  other vias: 43.13,72.84
N$160  (via drill 1.1)
  other vias: 40.59,72.84
N$161  (via drill 1.1)
  other vias: 38.05,72.84
N$162  (via drill 1.1)
  other vias: 35.51,72.84
N$163  (via drill 1.1)
  other vias: 32.97,72.84
N$164  (via drill 1.1)
  other vias: 30.43,72.84
N$165  (via drill 1.1)
  other vias: 27.89,72.84
N$166  (via drill 1.1)
  other vias: 25.35,72.84
N$167  (via drill 1.1)
  other vias: 22.81,72.84
N$168  (via drill 1.1)
  other vias: 20.27,72.84
N$169  (via drill 1.1)
  other vias: 17.73,72.84
N$171  (via drill 1.1)
  other vias: 50.75,70.3
N$172  (via drill 1.1)
  other vias: 48.21,70.3
N$173  (via drill 1.1)
  other vias: 45.67,70.3
N$174  (via drill 1.1)
  other vias: 43.13,70.3
N$175  (via drill 1.1)
  other vias: 40.59,70.3
N$176  (via drill 1.1)
  other vias: 38.05,70.3
N$177  (via drill 1.1)
  other vias: 35.51,70.3
N$178  (via drill 1.1)
  other vias: 32.97,70.3
N$179  (via drill 1.1)
  other vias: 30.43,70.3
N$180  (via drill 1.1)
  other vias: 27.89,70.3
N$181  (via drill 1.1)
  other vias: 25.35,70.3
N$182  (via drill 1.1)
  other vias: 22.81,70.3
N$183  (via drill 1.1)
  other vias: 20.27,70.3
N$184  (via drill 1.1)
  other vias: 17.73,70.3
N$186  (via drill 1.1)
  other vias: 50.75,67.76
N$187  (via drill 1.1)
  other vias: 48.21,67.76
N$188  (via drill 1.1)
  other vias: 45.67,67.76
N$189  (via drill 1.1)
  other vias: 43.13,67.76
N$190  (via drill 1.1)
  other vias: 40.59,67.76
N$191  (via drill 1.1)
  other vias: 38.05,67.76
N$192  (via drill 1.1)
  other vias: 35.51,67.76
N$193  (via drill 1.1)
  other vias: 32.97,67.76
N$194  (via drill 1.1)
  other vias: 30.43,67.76
N$195  (via drill 1.1)
  other vias: 27.89,67.76
N$196  (via drill 1.1)
  other vias: 25.35,67.76
N$197  (via drill 1.1)
  other vias: 22.81,67.76
N$198  (via drill 1.1)
  other vias: 20.27,67.76
N$199  (via drill 1.1)
  other vias: 17.73,67.76
N$201  (via drill 1.1)
  other vias: 50.75,65.22
N$202  (via drill 1.1)
  other vias: 48.21,65.22
N$203  (via drill 1.1)
  other vias: 45.67,65.22
N$204  (via drill 1.1)
  other vias: 43.13,65.22
N$205  (via drill 1.1)
  other vias: 40.59,65.22
N$206  (via drill 1.1)
  other vias: 38.05,65.22
N$207  (via drill 1.1)
  other vias: 35.51,65.22
N$208  (via drill 1.1)
  other vias: 32.97,65.22
N$209  (via drill 1.1)
  other vias: 30.43,65.22
N$210  (via drill 1.1)
  other vias: 27.89,65.22
N$211  (via drill 1.1)
  other vias: 25.35,65.22
N$212  (via drill 1.1)
  other vias: 22.81,65.22
N$213  (via drill 1.1)
  other vias: 20.27,65.22
N$214  (via drill 1.1)
  other vias: 17.73,65.22
N$216  (via drill 1.1)
  other vias: 50.75,62.68
N$217  (via drill 1.1)
  other vias: 48.21,62.68
N$218  (via drill 1.1)
  other vias: 45.67,62.68
N$219  (via drill 1.1)
  other vias: 43.13,62.68
N$220  (via drill 1.1)
  other vias: 40.59,62.68
N$221  (via drill 1.1)
  other vias: 38.05,62.68
N$222  (via drill 1.1)
  other vias: 35.51,62.68
N$223  (via drill 1.1)
  other vias: 32.97,62.68
N$224  (via drill 1.1)
  other vias: 30.43,62.68
N$225  (via drill 1.1)
  other vias: 27.89,62.68
N$226  (via drill 1.1)
  other vias: 25.35,62.68
N$227  (via drill 1.1)
  other vias: 22.81,62.68
N$228  (via drill 1.1)
  other vias: 20.27,62.68
N$229  (via drill 1.1)
  other vias: 17.73,62.68
N$231  (via drill 1.1)
  other vias: 50.75,60.14
N$232  (via drill 1.1)
  other vias: 48.21,60.14
N$233  (via drill 1.1)
  other vias: 45.67,60.14
N$234  (via drill 1.1)
  other vias: 43.13,60.14
N$235  (via drill 1.1)
  other vias: 40.59,60.14
N$236  (via drill 1.1)
  other vias: 38.05,60.14
N$237  (via drill 1.1)
  other vias: 35.51,60.14
N$238  (via drill 1.1)
  other vias: 32.97,60.14
N$239  (via drill 1.1)
  other vias: 30.43,60.14
N$240  (via drill 1.1)
  other vias: 27.89,60.14
N$241  (via drill 1.1)
  other vias: 25.35,60.14
N$242  (via drill 1.1)
  other vias: 22.81,60.14
N$243  (via drill 1.1)
  other vias: 20.27,60.14
N$244  (via drill 1.1)
  other vias: 17.73,60.14
N$246  (via drill 1.1)
  other vias: 50.75,57.6
N$247  (via drill 1.1)
  other vias: 48.21,57.6
N$248  (via drill 1.1)
  other vias: 45.67,57.6
N$249  (via drill 1.1)
  other vias: 43.13,57.6
N$250  (via drill 1.1)
  other vias: 40.59,57.6
N$251  (via drill 1.1)
  other vias: 38.05,57.6
N$252  (via drill 1.1)
  other vias: 35.51,57.6
N$253  (via drill 1.1)
  other vias: 32.97,57.6
N$254  (via drill 1.1)
  other vias: 30.43,57.6
N$255  (via drill 1.1)
  other vias: 27.89,57.6
N$256  (via drill 1.1)
  other vias: 25.35,57.6
N$257  (via drill 1.1)
  other vias: 22.81,57.6
N$258  (via drill 1.1)
  other vias: 20.27,57.6
N$259  (via drill 1.1)
  other vias: 17.73,57.6
N$261  (via drill 1.1)
  other vias: 50.75,55.06
N$262  (via drill 1.1)
  other vias: 48.21,55.06
N$263  (via drill 1.1)
  other vias: 45.67,55.06
N$264  (via drill 1.1)
  other vias: 43.13,55.06
N$265  (via drill 1.1)
  other vias: 40.59,55.06
N$266  (via drill 1.1)
  other vias: 38.05,55.06
N$267  (via drill 1.1)
  other vias: 35.51,55.06
N$268  (via drill 1.1)
  other vias: 32.97,55.06
N$269  (via drill 1.1)
  other vias: 30.43,55.06
N$270  (via drill 1.1)
  other vias: 27.89,55.06
N$271  (via drill 1.1)
  other vias: 25.35,55.06
N$272  (via drill 1.1)
  other vias: 22.81,55.06
N$273  (via drill 1.1)
  other vias: 20.27,55.06
N$274  (via drill 1.1)
  other vias: 17.73,55.06
N$276  (via drill 1.1)
  other vias: 50.75,44.9
N$277  (via drill 1.1)
  other vias: 48.21,44.9
N$278  (via drill 1.1)
  other vias: 45.67,44.9
N$279  (via drill 1.1)
  other vias: 43.13,44.9
N$280  (via drill 1.1)
  other vias: 40.59,44.9
N$281  (via drill 1.1)
  other vias: 38.05,44.9
N$282  (via drill 1.1)
  other vias: 35.51,44.9
N$283  (via drill 1.1)
  other vias: 32.97,44.9
N$284  (via drill 1.1)
  other vias: 30.43,44.9
N$285  (via drill 1.1)
  other vias: 27.89,44.9
N$286  (via drill 1.1)
  other vias: 25.35,44.9
N$287  (via drill 1.1)
  other vias: 22.81,44.9
N$288  (via drill 1.1)
  other vias: 20.27,44.9
N$289  (via drill 1.1)
  other vias: 17.73,44.9
N$291  (via drill 1.1)
  other vias: 50.75,42.36
N$292  (via drill 1.1)
  other vias: 48.21,42.36
N$293  (via drill 1.1)
  other vias: 45.67,42.36
N$294  (via drill 1.1)
  other vias: 43.13,42.36
N$295  (via drill 1.1)
  other vias: 40.59,42.36
N$296  (via drill 1.1)
  other vias: 38.05,42.36
N$297  (via drill 1.1)
  other vias: 35.51,42.36
N$298  (via drill 1.1)
  other vias: 32.97,42.36
N$299  (via drill 1.1)
  other vias: 30.43,42.36
N$300  (via drill 1.1)
  other vias: 27.89,42.36
N$301  (via drill 1.1)
  other vias: 25.35,42.36
N$302  (via drill 1.1)
  other vias: 22.81,42.36
N$303  (via drill 1.1)
  other vias: 20.27,42.36
N$304  (via drill 1.1)
  other vias: 17.73,42.36
N$306  (via drill 1.1)
  other vias: 50.75,39.82
N$307  (via drill 1.1)
  other vias: 48.21,39.82
N$308  (via drill 1.1)
  other vias: 45.67,39.82
N$309  (via drill 1.1)
  other vias: 43.13,39.82
N$310  (via drill 1.1)
  other vias: 40.59,39.82
N$311  (via drill 1.1)
  other vias: 38.05,39.82
N$312  (via drill 1.1)
  other vias: 35.51,39.82
N$313  (via drill 1.1)
  other vias: 32.97,39.82
N$314  (via drill 1.1)
  other vias: 30.43,39.82
N$315  (via drill 1.1)
  other vias: 27.89,39.82
N$316  (via drill 1.1)
  other vias: 25.35,39.82
N$317  (via drill 1.1)
  other vias: 22.81,39.82
N$318  (via drill 1.1)
  other vias: 20.27,39.82
N$319  (via drill 1.1)
  other vias: 17.73,39.82
N$321  (via drill 1.1)
  other vias: 50.75,37.28
N$322  (via drill 1.1)
  other vias: 48.21,37.28
N$323  (via drill 1.1)
  other vias: 45.67,37.28
N$324  (via drill 1.1)
  other vias: 43.13,37.28
N$325  (via drill 1.1)
  other vias: 40.59,37.28
N$326  (via drill 1.1)
  other vias: 38.05,37.28
N$327  (via drill 1.1)
  other vias: 35.51,37.28
N$328  (via drill 1.1)
  other vias: 32.97,37.28
N$329  (via drill 1.1)
  other vias: 30.43,37.28
N$330  (via drill 1.1)
  other vias: 27.89,37.28
N$331  (via drill 1.1)
  other vias: 25.35,37.28
N$332  (via drill 1.1)
  other vias: 22.81,37.28
N$333  (via drill 1.1)
  other vias: 20.27,37.28
N$334  (via drill 1.1)
  other vias: 17.73,37.28
N$336  (via drill 1.1)
  other vias: 50.75,34.74
N$337  (via drill 1.1)
  other vias: 48.21,34.74
N$338  (via drill 1.1)
  other vias: 45.67,34.74
N$339  (via drill 1.1)
  other vias: 43.13,34.74
N$340  (via drill 1.1)
  other vias: 40.59,34.74
N$341  (via drill 1.1)
  other vias: 38.05,34.74
N$342  (via drill 1.1)
  other vias: 35.51,34.74
N$343  (via drill 1.1)
  other vias: 32.97,34.74
N$344  (via drill 1.1)
  other vias: 30.43,34.74
N$345  (via drill 1.1)
  other vias: 27.89,34.74
N$346  (via drill 1.1)
  other vias: 25.35,34.74
N$347  (via drill 1.1)
  other vias: 22.81,34.74
N$348  (via drill 1.1)
  other vias: 20.27,34.74
N$349  (via drill 1.1)
  other vias: 17.73,34.74
N$351  (via drill 1.1)
  other vias: 50.75,32.2
N$352  (via drill 1.1)
  other vias: 48.21,32.2
N$353  (via drill 1.1)
  other vias: 45.67,32.2
N$354  (via drill 1.1)
  other vias: 43.13,32.2
N$355  (via drill 1.1)
  other vias: 40.59,32.2
N$356  (via drill 1.1)
  other vias: 38.05,32.2
N$357  (via drill 1.1)
  other vias: 35.51,32.2
N$358  (via drill 1.1)
  other vias: 32.97,32.2
N$359  (via drill 1.1)
  other vias: 30.43,32.2
N$360  (via drill 1.1)
  other vias: 27.89,32.2
N$361  (via drill 1.1)
  other vias: 25.35,32.2
N$362  (via drill 1.1)
  other vias: 22.81,32.2
N$363  (via drill 1.1)
  other vias: 20.27,32.2
N$364  (via drill 1.1)
  other vias: 17.73,32.2
N$366  (via drill 1.1)
  other vias: 50.75,29.66
N$367  (via drill 1.1)
  other vias: 48.21,29.66
N$368  (via drill 1.1)
  other vias: 45.67,29.66
N$369  (via drill 1.1)
  other vias: 43.13,29.66
N$370  (via drill 1.1)
  other vias: 40.59,29.66
N$371  (via drill 1.1)
  other vias: 38.05,29.66
N$372  (via drill 1.1)
  other vias: 35.51,29.66
N$373  (via drill 1.1)
  other vias: 32.97,29.66
N$374  (via drill 1.1)
  other vias: 30.43,29.66
N$375  (via drill 1.1)
  other vias: 27.89,29.66
N$376  (via drill 1.1)
  other vias: 25.35,29.66
N$377  (via drill 1.1)
  other vias: 22.81,29.66
N$378  (via drill 1.1)
  other vias: 20.27,29.66
N$379  (via drill 1.1)
  other vias: 17.73,29.66
N$381  (via drill 1.1)
  other vias: 50.75,27.12
N$382  (via drill 1.1)
  other vias: 48.21,27.12
N$383  (via drill 1.1)
  other vias: 45.67,27.12
N$384  (via drill 1.1)
  other vias: 43.13,27.12
N$385  (via drill 1.1)
  other vias: 40.59,27.12
N$386  (via drill 1.1)
  other vias: 38.05,27.12
N$387  (via drill 1.1)
  other vias: 35.51,27.12
N$388  (via drill 1.1)
  other vias: 32.97,27.12
N$389  (via drill 1.1)
  other vias: 30.43,27.12
N$390  (via drill 1.1)
  other vias: 27.89,27.12
N$391  (via drill 1.1)
  other vias: 25.35,27.12
N$392  (via drill 1.1)
  other vias: 22.81,27.12
N$393  (via drill 1.1)
  other vias: 20.27,27.12
N$394  (via drill 1.1)
  other vias: 17.73,27.12
N$396  (via drill 1.1)
  other vias: 50.75,24.58
N$397  (via drill 1.1)
  other vias: 48.21,24.58
N$398  (via drill 1.1)
  other vias: 45.67,24.58
N$399  (via drill 1.1)
  other vias: 43.13,24.58
N$400  (via drill 1.1)
  other vias: 40.59,24.58
N$401  (via drill 1.1)
  other vias: 38.05,24.58
N$402  (via drill 1.1)
  other vias: 35.51,24.58
N$403  (via drill 1.1)
  other vias: 32.97,24.58
N$404  (via drill 1.1)
  other vias: 30.43,24.58
N$405  (via drill 1.1)
  other vias: 27.89,24.58
N$406  (via drill 1.1)
  other vias: 25.35,24.58
N$407  (via drill 1.1)
  other vias: 22.81,24.58
N$408  (via drill 1.1)
  other vias: 20.27,24.58
N$409  (via drill 1.1)
  other vias: 17.73,24.58
N$411  (via drill 1.1)
  other vias: 50.75,22.04
N$412  (via drill 1.1)
  other vias: 48.21,22.04
N$413  (via drill 1.1)
  other vias: 45.67,22.04
N$414  (via drill 1.1)
  other vias: 43.13,22.04
N$415  (via drill 1.1)
  other vias: 40.59,22.04
N$416  (via drill 1.1)
  other vias: 38.05,22.04
N$417  (via drill 1.1)
  other vias: 35.51,22.04
N$418  (via drill 1.1)
  other vias: 32.97,22.04
N$419  (via drill 1.1)
  other vias: 30.43,22.04
N$420  (via drill 1.1)
  other vias: 27.89,22.04
N$421  (via drill 1.1)
  other vias: 25.35,22.04
N$422  (via drill 1.1)
  other vias: 22.81,22.04
N$423  (via drill 1.1)
  other vias: 20.27,22.04
N$424  (via drill 1.1)
  other vias: 17.73,22.04
N$426  (via drill 1.1)
  other vias: 50.75,19.5
N$427  (via drill 1.1)
  other vias: 48.21,19.5
N$428  (via drill 1.1)
  other vias: 45.67,19.5
N$429  (via drill 1.1)
  other vias: 43.13,19.5
N$430  (via drill 1.1)
  other vias: 40.59,19.5
N$431  (via drill 1.1)
  other vias: 38.05,19.5
N$432  (via drill 1.1)
  other vias: 35.51,19.5
N$433  (via drill 1.1)
  other vias: 32.97,19.5
N$434  (via drill 1.1)
  other vias: 30.43,19.5
N$435  (via drill 1.1)
  other vias: 27.89,19.5
N$436  (via drill 1.1)
  other vias: 25.35,19.5
N$437  (via drill 1.1)
  other vias: 22.81,19.5
N$438  (via drill 1.1)
  other vias: 20.27,19.5
N$439  (via drill 1.1)
  other vias: 17.73,19.5
N$441  (via drill 1.1)
  other vias: 50.75,16.96
N$442  (via drill 1.1)
  other vias: 48.21,16.96
N$443  (via drill 1.1)
  other vias: 45.67,16.96
N$444  (via drill 1.1)
  other vias: 43.13,16.96
N$445  (via drill 1.1)
  other vias: 40.59,16.96
N$446  (via drill 1.1)
  other vias: 38.05,16.96
N$447  (via drill 1.1)
  other vias: 35.51,16.96
N$448  (via drill 1.1)
  other vias: 32.97,16.96
N$449  (via drill 1.1)
  other vias: 30.43,16.96
N$450  (via drill 1.1)
  other vias: 27.89,16.96
N$451  (via drill 1.1)
  other vias: 25.35,16.96
N$452  (via drill 1.1)
  other vias: 22.81,16.96
N$453  (via drill 1.1)
  other vias: 20.27,16.96
N$454  (via drill 1.1)
  other vias: 17.73,16.96
N$456  (via drill 1.1)
  other vias: 50.75,14.42
N$457  (via drill 1.1)
  other vias: 48.21,14.42
N$458  (via drill 1.1)
  other vias: 45.67,14.42
N$459  (via drill 1.1)
  other vias: 43.13,14.42
N$460  (via drill 1.1)
  other vias: 40.59,14.42
N$461  (via drill 1.1)
  other vias: 38.05,14.42
N$462  (via drill 1.1)
  other vias: 35.51,14.42
N$463  (via drill 1.1)
  other vias: 32.97,14.42
N$464  (via drill 1.1)
  other vias: 30.43,14.42
N$465  (via drill 1.1)
  other vias: 27.89,14.42
N$466  (via drill 1.1)
  other vias: 25.35,14.42
N$467  (via drill 1.1)
  other vias: 22.81,14.42
N$468  (via drill 1.1)
  other vias: 20.27,14.42
N$469  (via drill 1.1)
  other vias: 17.73,14.42
N$471  (via drill 1.1)
  other vias: 50.75,11.88
N$472  (via drill 1.1)
  other vias: 48.21,11.88
N$473  (via drill 1.1)
  other vias: 45.67,11.88
N$474  (via drill 1.1)
  other vias: 43.13,11.88
N$475  (via drill 1.1)
  other vias: 40.59,11.88
N$476  (via drill 1.1)
  other vias: 38.05,11.88
N$477  (via drill 1.1)
  other vias: 35.51,11.88
N$478  (via drill 1.1)
  other vias: 32.97,11.88
N$479  (via drill 1.1)
  other vias: 30.43,11.88
N$480  (via drill 1.1)
  other vias: 27.89,11.88
N$481  (via drill 1.1)
  other vias: 25.35,11.88
N$482  (via drill 1.1)
  other vias: 22.81,11.88
N$483  (via drill 1.1)
  other vias: 20.27,11.88
N$484  (via drill 1.1)
  other vias: 17.73,11.88
N$486  (via drill 1.1)
  other vias: 50.75,9.34
N$487  (via drill 1.1)
  other vias: 48.21,9.34
N$488  (via drill 1.1)
  other vias: 45.67,9.34
N$489  (via drill 1.1)
  other vias: 43.13,9.34
N$490  (via drill 1.1)
  other vias: 40.59,9.34
N$491  (via drill 1.1)
  other vias: 38.05,9.34
N$492  (via drill 1.1)
  other vias: 35.51,9.34
N$493  (via drill 1.1)
  other vias: 32.97,9.34
N$494  (via drill 1.1)
  other vias: 30.43,9.34
N$495  (via drill 1.1)
  other vias: 27.89,9.34
N$496  (via drill 1.1)
  other vias: 25.35,9.34
N$497  (via drill 1.1)
  other vias: 22.81,9.34
N$498  (via drill 1.1)
  other vias: 20.27,9.34
N$499  (via drill 1.1)
  other vias: 17.73,9.34
N$501  (via drill 1.1)
  other vias: 50.75,6.8
N$502  (via drill 1.1)
  other vias: 48.21,6.8
N$503  (via drill 1.1)
  other vias: 45.67,6.8
N$504  (via drill 1.1)
  other vias: 43.13,6.8
N$505  (via drill 1.1)
  other vias: 40.59,6.8
N$506  (via drill 1.1)
  other vias: 38.05,6.8
N$507  (via drill 1.1)
  other vias: 35.51,6.8
N$508  (via drill 1.1)
  other vias: 32.97,6.8
N$509  (via drill 1.1)
  other vias: 30.43,6.8
N$510  (via drill 1.1)
  other vias: 27.89,6.8
N$511  (via drill 1.1)
  other vias: 25.35,6.8
N$512  (via drill 1.1)
  other vias: 22.81,6.8
N$513  (via drill 1.1)
  other vias: 20.27,6.8
N$514  (via drill 1.1)
  other vias: 17.73,6.8
N$516  (via drill 1.1)
  other vias: 50.75,52.52
N$517  (via drill 1.1)
  other vias: 48.21,52.52
N$518  (via drill 1.1)
  other vias: 45.67,52.52
N$519  (via drill 1.1)
  other vias: 43.13,52.52
N$520  (via drill 1.1)
  other vias: 40.59,52.52
N$521  (via drill 1.1)
  other vias: 38.05,52.52
N$522  (via drill 1.1)
  other vias: 35.51,52.52
N$523  (via drill 1.1)
  other vias: 32.97,52.52
N$524  (via drill 1.1)
  other vias: 30.43,52.52
N$525  (via drill 1.1)
  other vias: 27.89,52.52
N$526  (via drill 1.1)
  other vias: 25.35,52.52
N$527  (via drill 1.1)
  other vias: 22.81,52.52
N$528  (via drill 1.1)
  other vias: 20.27,52.52
N$529  (via drill 1.1)
  other vias: 17.73,52.52
N$531  (via drill 1.1)
  other vias: 50.75,49.98
N$532  (via drill 1.1)
  other vias: 48.21,49.98
N$533  (via drill 1.1)
  other vias: 45.67,49.98
N$534  (via drill 1.1)
  other vias: 43.13,49.98
N$535  (via drill 1.1)
  other vias: 40.59,49.98
N$536  (via drill 1.1)
  other vias: 38.05,49.98
N$537  (via drill 1.1)
  other vias: 35.51,49.98
N$538  (via drill 1.1)
  other vias: 32.97,49.98
N$539  (via drill 1.1)
  other vias: 30.43,49.98
N$540  (via drill 1.1)
  other vias: 27.89,49.98
N$541  (via drill 1.1)
  other vias: 25.35,49.98
N$542  (via drill 1.1)
  other vias: 22.81,49.98
N$543  (via drill 1.1)
  other vias: 20.27,49.98
N$544  (via drill 1.1)
  other vias: 17.73,49.98
N$546  (via drill 1.1)
  other vias: 50.75,47.44
N$547  (via drill 1.1)
  other vias: 48.21,47.44
N$548  (via drill 1.1)
  other vias: 45.67,47.44
N$549  (via drill 1.1)
  other vias: 43.13,47.44
N$550  (via drill 1.1)
  other vias: 40.59,47.44
N$551  (via drill 1.1)
  other vias: 38.05,47.44
N$552  (via drill 1.1)
  other vias: 35.51,47.44
N$553  (via drill 1.1)
  other vias: 32.97,47.44
N$554  (via drill 1.1)
  other vias: 30.43,47.44
N$555  (via drill 1.1)
  other vias: 27.89,47.44
N$556  (via drill 1.1)
  other vias: 25.35,47.44
N$557  (via drill 1.1)
  other vias: 22.81,47.44
N$558  (via drill 1.1)
  other vias: 20.27,47.44
N$559  (via drill 1.1)
  other vias: 17.73,47.44
READHI
  Bottom 0.406: DH.24 124.41,73.47 125.68,72.2 125.68,58.23 124.41,56.96 CH.24 124.41,51.88 125.68,50.61 125.68,37.91 124.41,36.64 BH.24 124.41,30.29 125.68,29.02 125.68,17.59 124.41,16.32 AH.24 JP6.1
READLO
  Bottom 0.406: DL.24 79.96,73.47 81.23,72.2 81.23,58.23 79.96,56.96 CL.24 79.96,51.88 81.23,50.61 81.23,37.91 79.96,36.64 BL.24 79.96,30.29 81.23,29.02 81.23,17.59 79.96,16.32 AL.24 JP8.1
VCC
  Top 1.27: U$1.5V 16.46,13.15
  Bottom 0.406: DL.32 C1.1 | DH.32 C2.1 | CL.32 C3.1 | CH.32 C6.1 | BL.32 C8.1 | BH.32 C7.1 | AL.32 C9.1 | AH.32 C10.1
  Bottom 0.61: DL.32 100.28,73.47 101.55,72.2 101.55,58.23 100.28,56.96 CL.32 100.28,51.88 101.55,50.61 101.55,37.91 100.28,36.64 BL.32
  pour Top: 0.59,2.99 143.46,2.99 arc90 148.54,8.07 148.54,91.89 arc90 143.46,96.97 0.59,96.97
WRITEHI
  Bottom 0.406: DH.29 137.11,73.47 138.38,72.2 138.38,58.23 137.11,56.96 CH.29 137.11,51.88 138.38,50.61 138.38,37.91 137.11,36.64 BH.29 137.11,30.29 138.38,29.02 138.38,17.59 137.11,16.32 AH.29 JP5.1
WRITELO
  Bottom 0.406: DL.29 92.66,73.47 93.93,72.2 93.93,58.23 92.66,56.96 CL.29 92.66,51.88 93.93,50.61 93.93,37.91 92.66,36.64 BL.29 92.66,30.29 93.93,29.02 93.93,17.59 92.66,16.32 AL.29 JP7.1

## Text on the board
tPlace: Four Megabytes of RAM | DL | DH | CL | CH | BL | BH | BENCHOFF 2015 | AL | AH
bPlace: D0 | 32 | C | A | D1 | D2 | D3 | D4 | D5 | D LO | D HI | D6 | D7 | A0 | /CS D | 1 | 2 | 3 | 4 | 5 | 6 | C LO | C HI | 7 | 8 | /CS C | 9 | 10 | 11 | 12 | 13 | 14 | B LO | 15 | B HI | 16 | 17 | /CS B | 18 | D8 | D9 | D10 | D11 | D12 | A LO | A HI | D13 | 1 | C | A | D14 | /CS A | D15 | ReadLo | WriteLo | ReadHi | WriteHi